# Altium schematic sheet MAXIM-ADC1.SchDoc
size B
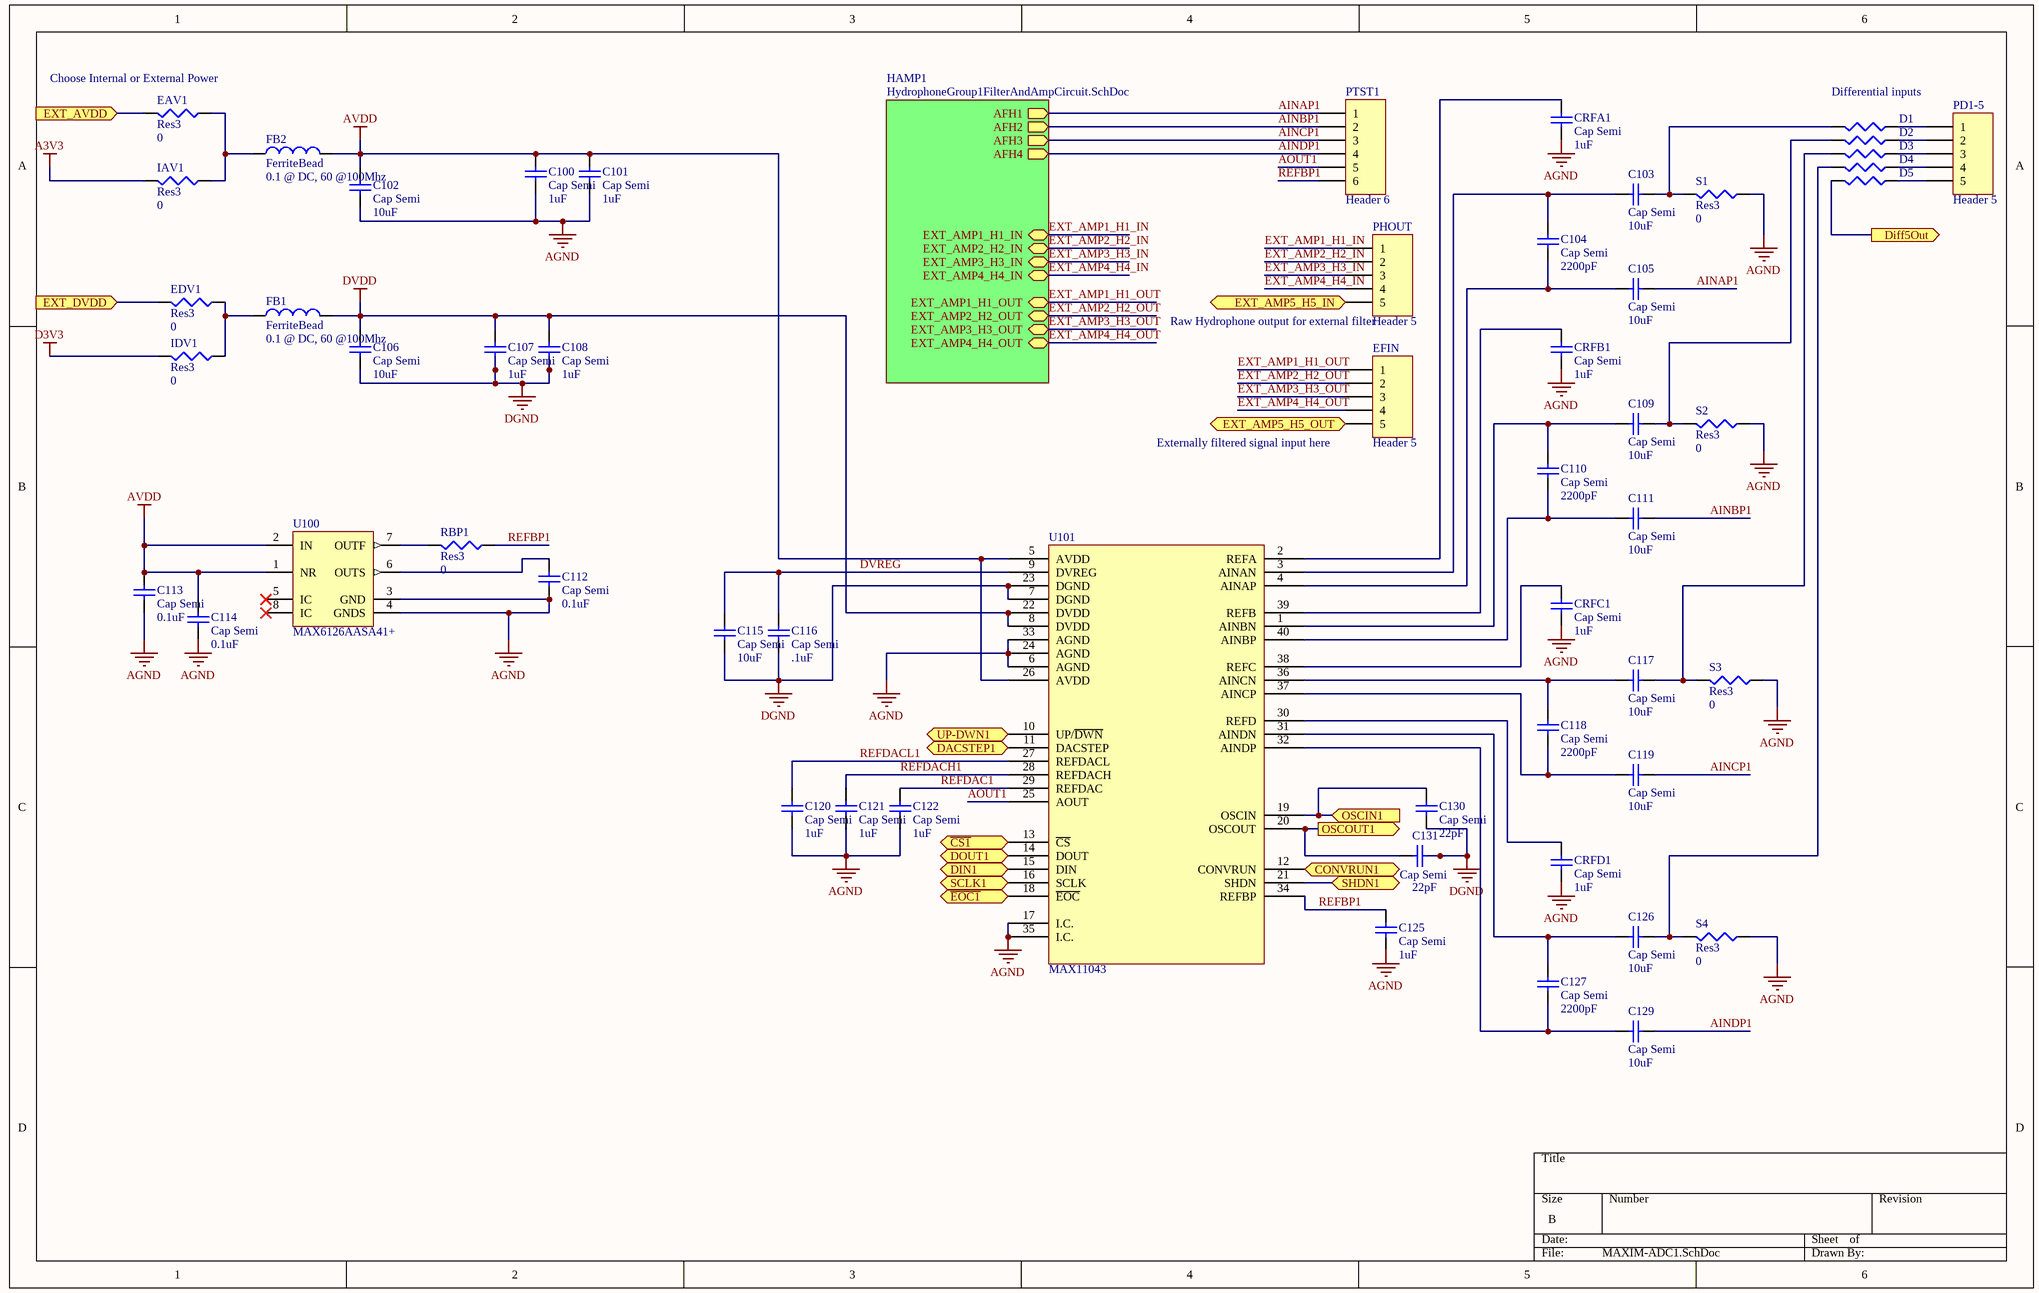
[diagram p0: MAXIM-ADC1.SchDoc]

## Parts
C100  Cap Semi  value 1uF  [1608[0603]]
C101  Cap Semi  value 1uF  [1608[0603]]
C102  Cap Semi  value 10uF  [1608[0603]]
C103  Cap Semi  value 10uF  [1608[0603]]
C104  Cap Semi  value 2200pF  [1608[0603]]
C105  Cap Semi  value 10uF  [1608[0603]]
C106  Cap Semi  value 10uF  [1608[0603]]
C107  Cap Semi  value 1uF  [1608[0603]]
C108  Cap Semi  value 1uF  [1608[0603]]
C109  Cap Semi  value 10uF  [1608[0603]]
C110  Cap Semi  value 2200pF  [1608[0603]]
C111  Cap Semi  value 10uF  [1608[0603]]
C112  Cap Semi  value 0.1uF  [1608[0603]]
C113  Cap Semi  value 0.1uF  [1608[0603]]
C114  Cap Semi  value 0.1uF  [1608[0603]]
C115  Cap Semi  value 10uF  [1608[0603]]
C116  Cap Semi  value .1uF  [1608[0603]]
C117  Cap Semi  value 10uF  [1608[0603]]
C118  Cap Semi  value 2200pF  [1608[0603]]
C119  Cap Semi  value 10uF  [1608[0603]]
C120  Cap Semi  value 1uF  [1608[0603]]
C121  Cap Semi  value 1uF  [1608[0603]]
C122  Cap Semi  value 1uF  [1608[0603]]
C125  Cap Semi  value 1uF  [1608[0603]]
C126  Cap Semi  value 10uF  [1608[0603]]
C127  Cap Semi  value 2200pF  [1608[0603]]
C129  Cap Semi  value 10uF  [1608[0603]]
C130  Cap Semi  value 22pF  [1608[0603]]
C131  Cap Semi  value 22pF  [1608[0603]]
CRFA1  Cap Semi  value 1uF  [1608[0603]]
CRFB1  Cap Semi  value 1uF  [1608[0603]]
CRFC1  Cap Semi  value 1uF  [1608[0603]]
CRFD1  Cap Semi  value 1uF  [1608[0603]]
D1  Res3  [J1-0603]  (value not drawn)
D2  Res3  [J1-0603]  (value not drawn)
D3  Res3  [J1-0603]  (value not drawn)
D4  Res3  [J1-0603]  (value not drawn)
D5  Res3  [J1-0603]  (value not drawn)
EAV1  Res3  value 0  [J1-0603]
EDV1  Res3  value 0  [J1-0603]
EFIN  Header 5  [HDR1X5]
FB1  FerriteBead  value 0.1 @ DC, 60 @100Mhz  [0603]
FB2  FerriteBead  value 0.1 @ DC, 60 @100Mhz  [0603]
IAV1  Res3  value 0  [J1-0603]
IDV1  Res3  value 0  [J1-0603]
PD1-5  Header 5  [HDR1X5]
PHOUT  Header 5  [HDR1X5]
PTST1  Header 6  [HDR1X6]
RBP1  Res3  value 0  [J1-0603]
S1  Res3  value 0  [J1-0603]
S2  Res3  value 0  [J1-0603]
S3  Res3  value 0  [J1-0603]
S4  Res3  value 0  [J1-0603]
U100  MAX6126AASA41+  [MAXM-S8+4_L]
U101  MAX11043  [QFN50P600X600X80_HS-41N]

## Sub-sheets
HAMP1 = HydrophoneGroup1FilterAndAmpCircuit.SchDoc: AFH1 (out), AFH2 (out), AFH3 (out), AFH4 (out), EXT_AMP1_H1_IN, EXT_AMP2_H2_IN, EXT_AMP3_H3_IN, EXT_AMP4_H4_IN, EXT_AMP1_H1_OUT, EXT_AMP2_H2_OUT, EXT_AMP3_H3_OUT, EXT_AMP4_H4_OUT

## Ports
CONVRUN1 (in), DACSTEP1 (in), Diff5Out (out), DIN1 (in), DOUT1 (out), EXT_AMP5_H5_IN (in), EXT_AMP5_H5_OUT (out), EXT_AVDD (in), EXT_DVDD (in), OSCIN1 (in), OSCOUT1 (out), SCLK1 (in), SHDN1, UP-DWN1 (in), ~{CS1} (in), ~{EOC1} (out)

## Nets
A3V3: IAV1.2
AGND: C100.2 C101.2 C102.2 C112.2 C113.2 C114.2 C120.1 C121.2 C122.1 C125.2 CRFA1.1 CRFB1.1 CRFC1.1 CRFD1.1 S1.1 S2.1 S3.1 S4.1 U100.3(GND) U100.4(GNDS) U101.6(AGND) U101.17(I.C.) U101.24(AGND) U101.33(AGND) U101.35(I.C.)
AVDD: C100.1 C101.1 C102.1 C113.1 C114.1 FB2.2 U100.1(NR) U100.2(IN) U101.5(AVDD) U101.26(AVDD)
D3V3: IDV1.2
DGND: C106.2 C107.2 C108.2 C115.2 C116.2 C130.2 C131.2 U101.7(DGND) U101.23(DGND)
DVDD: C106.1 C107.1 C108.1 FB1.2 U101.8(DVDD) U101.22(DVDD)
AINAP1: C105.1 PTST1.1 ; sheet HAMP1/AFH1
AINBP1: C111.1 PTST1.2 ; sheet HAMP1/AFH2
AINCP1: C119.1 PTST1.3 ; sheet HAMP1/AFH3
AINDP1: C129.1 PTST1.4 ; sheet HAMP1/AFH4
AOUT1: PTST1.5 U101.25(AOUT)
~{CS1}: U101.13(~{CS}) ; port ~{CS1}
CONVRUN1: U101.12(CONVRUN) ; port CONVRUN1
DACSTEP1: U101.11(DACSTEP) ; port DACSTEP1
Diff5Out: D5.2 ; port Diff5Out
DIN1: U101.15(DIN) ; port DIN1
DOUT1: U101.14(DOUT) ; port DOUT1
DVREG: C115.1 C116.1 U101.9(DVREG)
~{EOC1}: U101.18(~{EOC}) ; port ~{EOC1}
EXT_AMP1_H1_IN: PHOUT.1 ; sheet HAMP1/EXT_AMP1_H1_IN
EXT_AMP1_H1_OUT: EFIN.1 ; sheet HAMP1/EXT_AMP1_H1_OUT
EXT_AMP2_H2_IN: PHOUT.2 ; sheet HAMP1/EXT_AMP2_H2_IN
EXT_AMP2_H2_OUT: EFIN.2 ; sheet HAMP1/EXT_AMP2_H2_OUT
EXT_AMP3_H3_IN: PHOUT.3 ; sheet HAMP1/EXT_AMP3_H3_IN
EXT_AMP3_H3_OUT: EFIN.3 ; sheet HAMP1/EXT_AMP3_H3_OUT
EXT_AMP4_H4_IN: PHOUT.4 ; sheet HAMP1/EXT_AMP4_H4_IN
EXT_AMP4_H4_OUT: EFIN.4 ; sheet HAMP1/EXT_AMP4_H4_OUT
EXT_AMP5_H5_IN: PHOUT.5 ; port EXT_AMP5_H5_IN
EXT_AMP5_H5_OUT: EFIN.5 ; port EXT_AMP5_H5_OUT
EXT_AVDD: EAV1.2 ; port EXT_AVDD
EXT_DVDD: EDV1.2 ; port EXT_DVDD
OSCIN1: C130.1 U101.19(OSCIN) ; port OSCIN1
OSCOUT1: C131.1 U101.20(OSCOUT) ; port OSCOUT1
REFBP1: C125.1 PTST1.6 RBP1.1 U101.34(REFBP)
REFDAC1: C122.2 U101.29(REFDAC)
REFDACH1: C121.1 U101.28(REFDACH)
REFDACL1: C120.2 U101.27(REFDACL)
SCLK1: U101.16(SCLK) ; port SCLK1
SHDN1: U101.21(SHDN) ; port SHDN1
UP-DWN1: U101.10(UP/~{DWN}) ; port UP-DWN1
NetC103_1: C103.1 D1.2 S1.2
NetC103_2: C103.2 C104.2 U101.3(AINAN)
NetC104_1: C104.1 C105.2 U101.4(AINAP)
NetC109_1: C109.1 D2.2 S2.2
NetC109_2: C109.2 C110.2 U101.1(AINBN)
NetC110_1: C110.1 C111.2 U101.40(AINBP)
NetC112_1: C112.1 U100.6(OUTS)
NetC117_1: C117.1 D3.2 S3.2
NetC117_2: C117.2 C118.2 U101.36(AINCN)
NetC118_1: C118.1 C119.2 U101.37(AINCP)
NetC126_1: C126.1 D4.2 S4.2
NetC126_2: C126.2 C127.2 U101.31(AINDN)
NetC127_1: C127.1 C129.2 U101.32(AINDP)
NetCRFA1_2: CRFA1.2 U101.2(REFA)
NetCRFB1_2: CRFB1.2 U101.39(REFB)
NetCRFC1_2: CRFC1.2 U101.38(REFC)
NetCRFD1_2: CRFD1.2 U101.30(REFD)
NetD1_1: D1.1 PD1-5.1
NetD2_1: D2.1 PD1-5.2
NetD3_1: D3.1 PD1-5.3
NetD4_1: D4.1 PD1-5.4
NetD5_1: D5.1 PD1-5.5
NetEAV1_1: EAV1.1 FB2.1 IAV1.1
NetEDV1_1: EDV1.1 FB1.1 IDV1.1
NetRBP1_2: RBP1.2 U100.7(OUTF)

Not connected (* = marked no-connect by the designer): U100 5(IC)* 8(IC)*

## Notes on the sheet
- (near EAV1) Choose Internal or External Power
- Differential inputs
- (near PHOUT) Raw Hydrophone output for external filter
- (near EFIN) Externally filtered signal input here

## Library data of the parts
C100-C122 C125-C127 C129-C131 CRFA1 CRFB1 CRFC1 CRFD1 = Cap Semi: Capacitor (Semiconductor SIM Model); Published: 8-Jun-2000; LatestRevisionDate: 29-May-2009; LatestRevisionNote: IPC-7351 Footprint Added.; PackageReference: C1206; Publisher: Altium Limited; PackageDescription: Chip Capacitor
D1-D5 = Res3: Resistor; Value: 0; Published: 8-Jun-2000; LatestRevisionDate: 29-May-2009; LatestRevisionNote: IPC-7351 Footprint Added.; PackageReference: J1-0603; Publisher: Altium Limited; PackageDescription: Chip Resistor
EAV1 EDV1 IAV1 IDV1 RBP1 S1-S4 = Res3: Resistor; Published: 8-Jun-2000; LatestRevisionDate: 29-May-2009; LatestRevisionNote: IPC-7351 Footprint Added.; PackageReference: J1-0603; Publisher: Altium Limited; PackageDescription: Chip Resistor
EFIN PD1-5 PHOUT = Header 5: Header, 5-Pin; LatestRevisionDate: 17-Jul-2002; LatestRevisionNote: Re-released for DXP Platform.; Publisher: Altium Limited
FB1 FB2 = Inductor: Code_IEC: 1005; Published: 8-Jun-2000; LatestRevisionDate: 29-May-2009; LatestRevisionNote: IPC-7351 Footprint Added.; PackageReference: 0402-A; Publisher: Altium Limited; PackageDescription: Chip Inductor; Code_JEITA: 0402
PTST1 = Header 6: ADC1 signal test; LatestRevisionDate: 17-Jul-2002; LatestRevisionNote: Re-released for DXP Platform.; Publisher: Altium Limited
U100 = CMP-0977-00016-1: Ultra-High-Precision, Ultra-Low-Noise, Series Voltage Reference, 4.096 V, -40 to 125 degC, 8-Pin SOIC (S8+4), RoHS, Tube; Manufacturer: Maxim; Output Voltage Accuracy: 0.02% Max.; Line Regulation: 60 uV/V Max.; VOUT: 4.096 V; Dropout Voltage@10 mA: 0.1 V Typ.; VIN: 4.3 to 12.6 V; Operating Temperature: -40 to 125 degC; ComponentLink3URL: http://pdfserv.maximintegrated.com/package_dwgs/21-0041.PDF; PartNumber: MAX6126AASA41+; RoHS: TRUE; ComponentLink3Description: Package Specification; ComponentLink1URL: http://www.maximintegrated.com/; Mounting Technology: Surface Mount; Packing: Tube; DatasheetVersion: Rev. 6; ComponentLink1Description: Manufacturer URL; ComponentLink2URL: http://datasheets.maximintegrated.com/en/ds/MAX6126.pdf; PackageDescription: 8-Pin Small Outline Integrated Circuit Package, Body 4.9 x 3.9 mm, Pitch 1.27 mm; ComponentLink2Description: Datasheet; PackageVersion: Rev. E